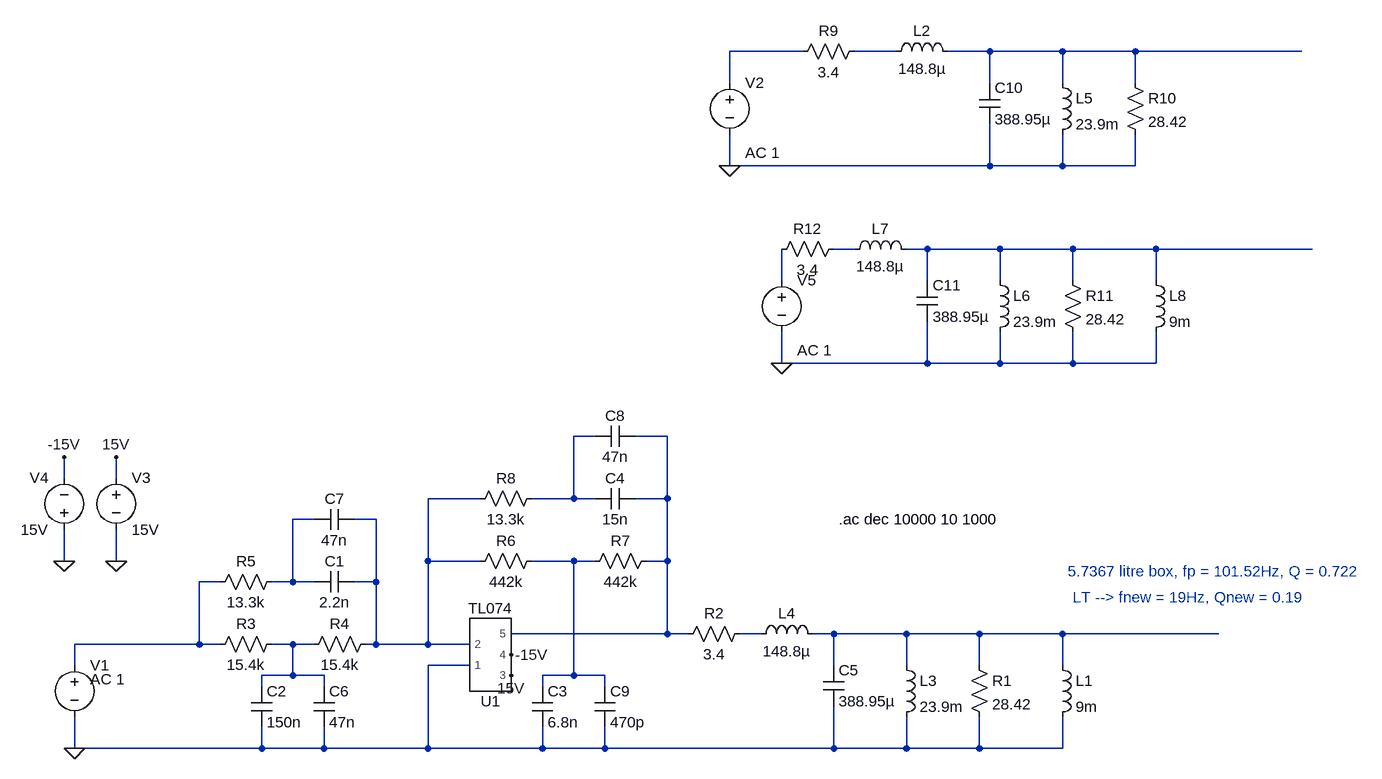
[diagram p0: schematic pyle_comp.asc]
pyle_comp.asc, the LTspice schematic file:
Version 4
SHEET 1 1108 1288
WIRE -336 -128 -448 -128
WIRE -192 -128 -256 -128
WIRE -48 -128 -112 -128
WIRE 64 -128 -48 -128
WIRE 176 -128 64 -128
WIRE 432 -128 176 -128
WIRE -448 -80 -448 -128
WIRE -48 -80 -48 -128
WIRE 64 -80 64 -128
WIRE 176 -80 176 -128
WIRE -448 48 -448 0
WIRE -48 48 -48 -16
WIRE -48 48 -448 48
WIRE 64 48 64 0
WIRE 64 48 -48 48
WIRE 176 48 176 0
WIRE 176 48 64 48
WIRE -256 176 -288 176
WIRE -144 176 -176 176
WIRE -32 176 -144 176
WIRE 80 176 -32 176
WIRE 208 176 80 176
WIRE 448 176 208 176
WIRE -368 224 -368 176
WIRE -144 224 -144 176
WIRE -32 224 -32 176
WIRE 80 224 80 176
WIRE 208 224 208 176
WIRE -368 352 -368 304
WIRE -144 352 -144 288
WIRE -144 352 -368 352
WIRE -32 352 -32 304
WIRE -32 352 -144 352
WIRE 80 352 80 304
WIRE 80 352 -32 352
WIRE 208 352 208 304
WIRE 208 352 80 352
WIRE -656 464 -688 464
WIRE -544 464 -592 464
WIRE -1472 528 -1472 496
WIRE -1392 528 -1392 496
WIRE -832 560 -912 560
WIRE -688 560 -688 464
WIRE -688 560 -752 560
WIRE -656 560 -688 560
WIRE -544 560 -544 464
WIRE -544 560 -592 560
WIRE -1088 592 -1120 592
WIRE -992 592 -1024 592
WIRE -1472 656 -1472 608
WIRE -1392 656 -1392 608
WIRE -912 656 -912 560
WIRE -832 656 -912 656
WIRE -688 656 -752 656
WIRE -656 656 -688 656
WIRE -544 656 -544 560
WIRE -544 656 -576 656
WIRE -1232 688 -1264 688
WIRE -1120 688 -1120 592
WIRE -1120 688 -1152 688
WIRE -1088 688 -1120 688
WIRE -992 688 -992 592
WIRE -992 688 -1024 688
WIRE -544 768 -544 656
WIRE -544 768 -784 768
WIRE -512 768 -544 768
WIRE -400 768 -432 768
WIRE -288 768 -320 768
WIRE -176 768 -288 768
WIRE -64 768 -176 768
WIRE 64 768 -64 768
WIRE 304 768 64 768
WIRE -1264 784 -1264 688
WIRE -1264 784 -1456 784
WIRE -1232 784 -1264 784
WIRE -1120 784 -1152 784
WIRE -1088 784 -1120 784
WIRE -992 784 -992 688
WIRE -992 784 -1008 784
WIRE -912 784 -912 656
WIRE -912 784 -992 784
WIRE -848 784 -912 784
WIRE -1456 816 -1456 784
WIRE -848 816 -912 816
WIRE -288 816 -288 768
WIRE -176 816 -176 768
WIRE -64 816 -64 768
WIRE 64 816 64 768
WIRE -1120 832 -1120 784
WIRE -1120 832 -1168 832
WIRE -1072 832 -1120 832
WIRE -688 832 -688 656
WIRE -688 832 -736 832
WIRE -640 832 -688 832
WIRE -1168 848 -1168 832
WIRE -1072 848 -1072 832
WIRE -736 848 -736 832
WIRE -640 848 -640 832
WIRE -1456 944 -1456 896
WIRE -1168 944 -1168 912
WIRE -1168 944 -1456 944
WIRE -1072 944 -1072 912
WIRE -1072 944 -1168 944
WIRE -912 944 -912 816
WIRE -912 944 -1072 944
WIRE -736 944 -736 912
WIRE -736 944 -912 944
WIRE -640 944 -640 912
WIRE -640 944 -736 944
WIRE -288 944 -288 880
WIRE -288 944 -640 944
WIRE -176 944 -176 896
WIRE -176 944 -288 944
WIRE -64 944 -64 896
WIRE -64 944 -176 944
WIRE 64 944 64 896
WIRE 64 944 -64 944
FLAG -1456 944 0
FLAG -784 832 15V
FLAG -784 800 -15V
FLAG -1392 496 15V
FLAG -1392 656 0
FLAG -1472 656 0
FLAG -1472 496 -15V
FLAG -448 48 0
FLAG -368 352 0
SYMBOL cap -304 816 R0
SYMATTR InstName C5
SYMATTR Value 388.95µ
SYMBOL ind -192 800 R0
SYMATTR InstName L3
SYMATTR Value 23.9m
SYMBOL res -80 800 R0
SYMATTR InstName R1
SYMATTR Value 28.42
SYMBOL res -416 752 R90
WINDOW 0 0 56 VBottom 2
WINDOW 3 32 56 VTop 2
SYMATTR InstName R2
SYMATTR Value 3.4
SYMBOL ind -416 784 R270
WINDOW 0 32 56 VTop 2
WINDOW 3 5 56 VBottom 2
SYMATTR InstName L4
SYMATTR Value 148.8µ
SYMBOL ind 48 800 R0
SYMATTR InstName L1
SYMATTR Value 9m
SYMBOL voltage -1456 800 R0
WINDOW 123 24 38 Left 2
WINDOW 39 0 0 Left 0
WINDOW 3 24 44 Left 2
SYMATTR Value2 AC 1
SYMATTR Value ""
SYMATTR InstName V1
SYMBOL res -1136 768 R90
WINDOW 0 0 56 VBottom 2
WINDOW 3 32 56 VTop 2
SYMATTR InstName R3
SYMATTR Value 15.4k
SYMBOL res -992 768 R90
WINDOW 0 0 56 VBottom 2
WINDOW 3 32 56 VTop 2
SYMATTR InstName R4
SYMATTR Value 15.4k
SYMBOL res -1136 672 R90
WINDOW 0 0 56 VBottom 2
WINDOW 3 32 56 VTop 2
SYMATTR InstName R5
SYMATTR Value 13.3k
SYMBOL cap -1024 672 R90
WINDOW 0 0 32 VBottom 2
WINDOW 3 32 32 VTop 2
SYMATTR InstName C1
SYMATTR Value 2.2n
SYMBOL cap -1184 848 R0
SYMATTR InstName C2
SYMATTR Value 150n
SYMBOL res -736 640 R90
WINDOW 0 0 56 VBottom 2
WINDOW 3 32 56 VTop 2
SYMATTR InstName R6
SYMATTR Value 442k
SYMBOL cap -752 848 R0
SYMATTR InstName C3
SYMATTR Value 6.8n
SYMBOL res -560 640 R90
WINDOW 0 0 56 VBottom 2
WINDOW 3 32 56 VTop 2
SYMATTR InstName R7
SYMATTR Value 442k
SYMBOL res -736 544 R90
WINDOW 0 0 56 VBottom 2
WINDOW 3 32 56 VTop 2
SYMATTR InstName R8
SYMATTR Value 13.3k
SYMBOL cap -592 544 R90
WINDOW 0 0 32 VBottom 2
WINDOW 3 32 32 VTop 2
SYMATTR InstName C4
SYMATTR Value 15n
SYMBOL cap -1088 848 R0
SYMATTR InstName C6
SYMATTR Value 47n
SYMBOL cap -1024 576 R90
WINDOW 0 0 32 VBottom 2
WINDOW 3 32 32 VTop 2
SYMATTR InstName C7
SYMATTR Value 47n
SYMBOL cap -592 448 R90
WINDOW 0 0 32 VBottom 2
WINDOW 3 32 32 VTop 2
SYMATTR InstName C8
SYMATTR Value 47n
SYMBOL cap -656 848 R0
SYMATTR InstName C9
SYMATTR Value 470p
SYMBOL voltage -1392 512 R0
SYMATTR InstName V3
SYMATTR Value 15V
SYMBOL voltage -1472 624 R180
WINDOW 0 24 96 Left 2
WINDOW 3 24 16 Left 2
SYMATTR InstName V4
SYMATTR Value 15V
SYMBOL voltage -448 -96 R0
WINDOW 123 24 124 Left 2
WINDOW 39 0 0 Left 0
SYMATTR Value2 AC 1
SYMATTR InstName V2
SYMATTR Value ""
SYMBOL res -240 -144 R90
WINDOW 0 0 56 VBottom 2
WINDOW 3 32 56 VTop 2
SYMATTR InstName R9
SYMATTR Value 3.4
SYMBOL ind -208 -112 R270
WINDOW 0 32 56 VTop 2
WINDOW 3 5 56 VBottom 2
SYMATTR InstName L2
SYMATTR Value 148.8µ
SYMBOL cap -64 -80 R0
SYMATTR InstName C10
SYMATTR Value 388.95µ
SYMBOL ind 48 -96 R0
SYMATTR InstName L5
SYMATTR Value 23.9m
SYMBOL res 160 -96 R0
SYMATTR InstName R10
SYMATTR Value 28.42
SYMBOL cap -160 224 R0
SYMATTR InstName C11
SYMATTR Value 388.95µ
SYMBOL ind -48 208 R0
SYMATTR InstName L6
SYMATTR Value 23.9m
SYMBOL res 64 208 R0
SYMATTR InstName R11
SYMATTR Value 28.42
SYMBOL res -272 160 R90
WINDOW 0 0 56 VBottom 2
WINDOW 3 32 56 VTop 2
SYMATTR InstName R12
SYMATTR Value 3.4
SYMBOL ind -272 192 R270
WINDOW 0 32 56 VTop 2
WINDOW 3 5 56 VBottom 2
SYMATTR InstName L7
SYMATTR Value 148.8µ
SYMBOL ind 192 208 R0
SYMATTR InstName L8
SYMATTR Value 9m
SYMBOL voltage -368 208 R0
WINDOW 123 24 124 Left 2
WINDOW 39 0 0 Left 0
SYMATTR Value2 AC 1
SYMATTR InstName V5
SYMATTR Value ""
SYMBOL AutoGenerated/TL074 -816 800 M180
SYMATTR InstName U1
TEXT -280 592 Left 2 !.ac dec 10000 10 1000
TEXT 72 672 Left 2 ;5.7367 litre box, fp = 101.52Hz, Q = 0.722
TEXT 80 712 Left 2 ;LT --> fnew = 19Hz, Qnew = 0.19

The netlist it stands for:
* pyle_comp.asc
C5 N014 0 388.95µ
L3 N014 0 23.9m
R1 N014 0 28.42
R2 N013 N008 3.4
L4 N013 N014 148.8µ
L1 N014 0 9m
V1 N012 0 AC 1
R3 N015 N012 15.4k
R4 N009 N015 15.4k
R5 N010 N012 13.3k
C1 N009 N010 2.2n
C2 N015 0 150n
R6 N011 N009 442k
C3 N011 0 6.8n
R7 N008 N011 442k
R8 N007 N009 13.3k
C4 N008 N007 15n
C6 N015 0 47n
C7 N009 N010 47n
C8 N008 N007 47n
C9 N011 0 470p
V3 15V 0 15V
V4 0 -15V 15V
V2 N001 0 AC 1
R9 N002 N001 3.4
L2 N002 N003 148.8µ
C10 N003 0 388.95µ
L5 N003 0 23.9m
R10 N003 0 28.42
C11 N005 0 388.95µ
L6 N005 0 23.9m
R11 N005 0 28.42
R12 N004 N006 3.4
L7 N004 N005 148.8µ
L8 N005 0 9m
V5 N006 0 AC 1
XU1 0 N009 15V -15V N008 TL074  ; pins 1 2 3 4 5
.ac dec 10000 10 1000
* 5.7367 litre box, fp = 101.52Hz, Q = 0.722
* LT --> fnew = 19Hz, Qnew = 0.19
.lib /Users/sujit/Documents/UNIVERSITY/3rd Year Project/git/3rd-year-project/OpenLoopDesign/Simulations/LTspice/PylePLPW6D/Datasheet/TL074.301
.backanno
.end